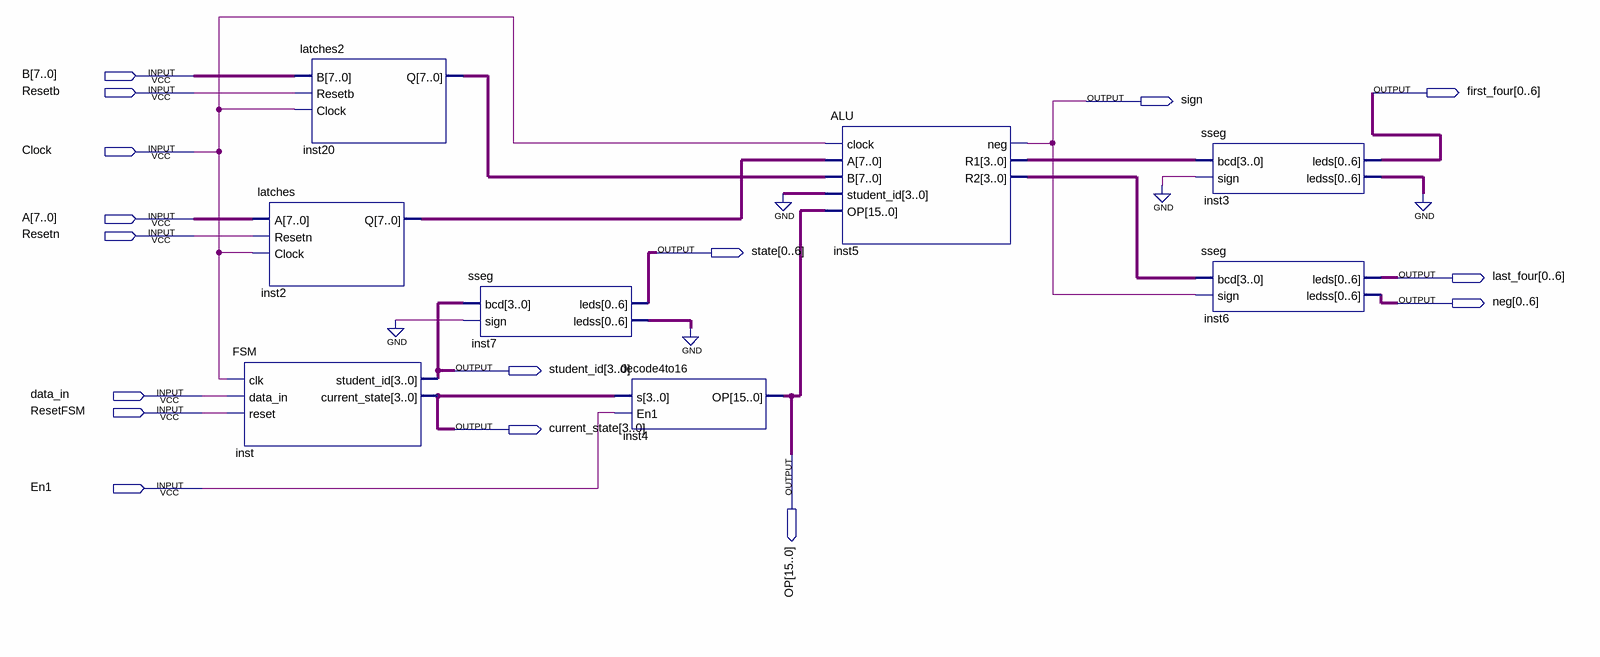
[diagram p0: schematic sheet]
// Quartus schematic Lab6Block.bdf as structural Verilog: 8 symbols, 16 pins
module Lab6Block (
  input  [7:0] B,
  input  Resetb,
  input  Clock,
  input  [7:0] A,
  input  Resetn,
  input  data_in,
  input  ResetFSM,
  input  En1,
  output [0:6] first_four,
  output sign,
  output [0:6] state,
  output [0:6] last_four,
  output [0:6] neg,
  output [3:0] student_id,
  output [3:0] current_state,
  output [15:0] OP
);

  wire [3:0] inst5_r1, inst5_r2;
  wire [6:0] inst3_ledss, inst7_ledss;
  wire [7:0] inst2_q, inst20_q;

  latches inst2 (.A(A), .Resetn(Resetn), .Clock(Clock), .Q(inst2_q));
  FSM inst (.clk(Clock), .data_in(data_in), .reset(ResetFSM), .student_id(student_id), .current_state(current_state));
  latches2 inst20 (.B(B), .Resetb(Resetb), .Clock(Clock), .Q(inst20_q));
  sseg inst7 (.bcd(student_id), .sign(1'b0), .leds(state), .ledss(inst7_ledss));
  decode4to16 inst4 (.s(current_state), .En1(En1), .OP(OP));
  ALU inst5 (
    .clock(Clock), .A(inst2_q), .B(inst20_q), .student_id(4'b0000), .OP(OP), .neg(sign), .R1(inst5_r1),
    .R2(inst5_r2));
  sseg inst3 (.bcd(inst5_r1), .sign(1'b0), .leds(first_four), .ledss(inst3_ledss));
  sseg inst6 (.bcd(inst5_r2), .sign(sign), .leds(last_four), .ledss(neg));
  // also tied to GND on the sheet: {inst7_ledss[0], inst7_ledss[1], inst7_ledss[2], inst7_ledss[3], inst7_ledss[4], inst7_ledss[5], inst7_ledss[6], inst3_ledss[0], inst3_ledss[1], inst3_ledss[2], inst3_ledss[3], inst3_ledss[4], inst3_ledss[5], inst3_ledss[6]}
endmodule
